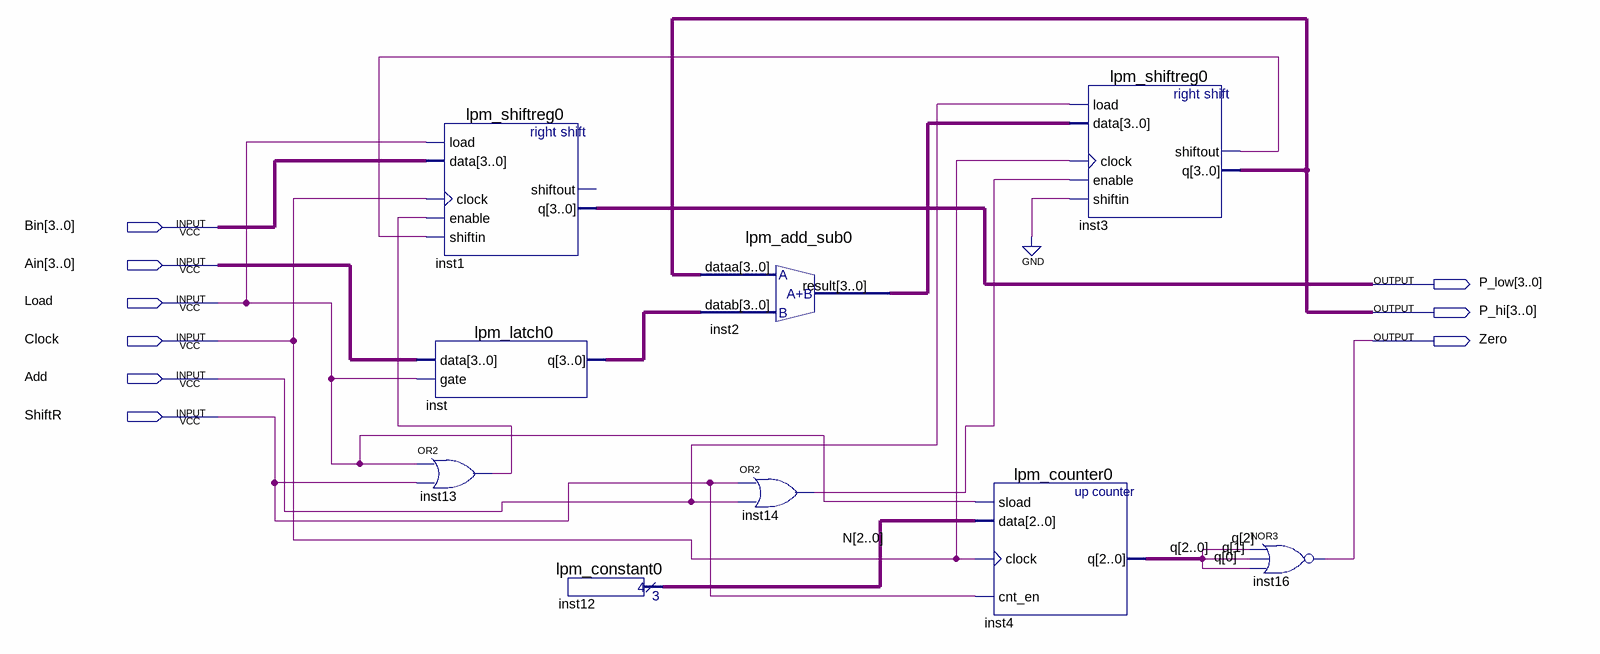
[diagram p0: schematic sheet]
// Quartus schematic Block1.bdf as structural Verilog: 9 symbols, 9 pins
module Block1 (
  input  [3:0] Bin,
  input  [3:0] Ain,
  input  Load,
  input  Clock,
  input  Add,
  input  ShiftR,
  output [3:0] P_low,
  output [3:0] P_hi,
  output Zero
);

  wire inst3_shiftout, inst13_out, inst14_out;
  wire [2:0] N, q;
  wire [3:0] inst2_result, inst_q;

  lpm_shiftreg0 inst1 (
    .load(Load), .data(Bin), .clock(Clock), .enable(inst13_out), .shiftin(inst3_shiftout), .q(P_low));  // open: shiftout
  lpm_latch0 inst (.data(Ain), .gate(Load), .q(inst_q));
  or inst13 (inst13_out, Load, ShiftR);
  lpm_constant0 inst12 (.result(N));
  lpm_add_sub0 inst2 (.dataa(P_hi), .datab(inst_q), .result(inst2_result));
  or inst14 (inst14_out, ShiftR, Add);
  lpm_counter0 inst4 (.sload(Load), .data(N), .clock(Clock), .cnt_en(ShiftR), .q(q));
  lpm_shiftreg0 inst3 (
    .load(Add), .data(inst2_result), .clock(Clock), .enable(inst14_out), .shiftin(1'b0),
    .shiftout(inst3_shiftout), .q(P_hi));
  nor inst16 (Zero, q[2], q[1], q[0]);
endmodule
